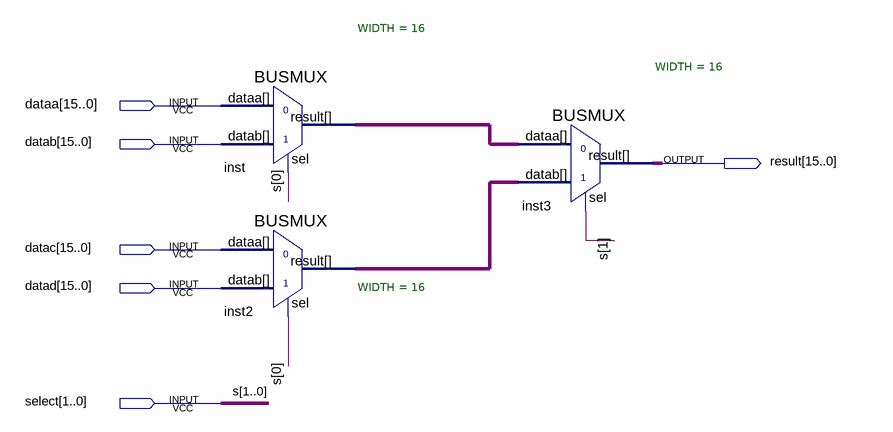
[diagram p0: schematic sheet]
// Quartus schematic busmux_4.bdf as structural Verilog: 3 symbols, 6 pins
module busmux_4 (
  input  [15:0] dataa,
  input  [15:0] datab,
  input  [15:0] datac,
  input  [15:0] datad,
  input  [1:0] select,
  output [15:0] result
);

  wire [15:0] inst2_result, inst_result;

  BUSMUX #(.WIDTH(16)) inst (.datab(datab), .sel(select[0]), .dataa(dataa), .result(inst_result));
  BUSMUX #(.WIDTH(16)) inst2 (.datab(datad), .sel(select[0]), .dataa(datac), .result(inst2_result));
  BUSMUX #(.WIDTH(16)) inst3 (.datab(inst2_result), .sel(select[1]), .dataa(inst_result), .result(result));

  // Other names for the same wires on the sheet: s[1:0] = select
endmodule
